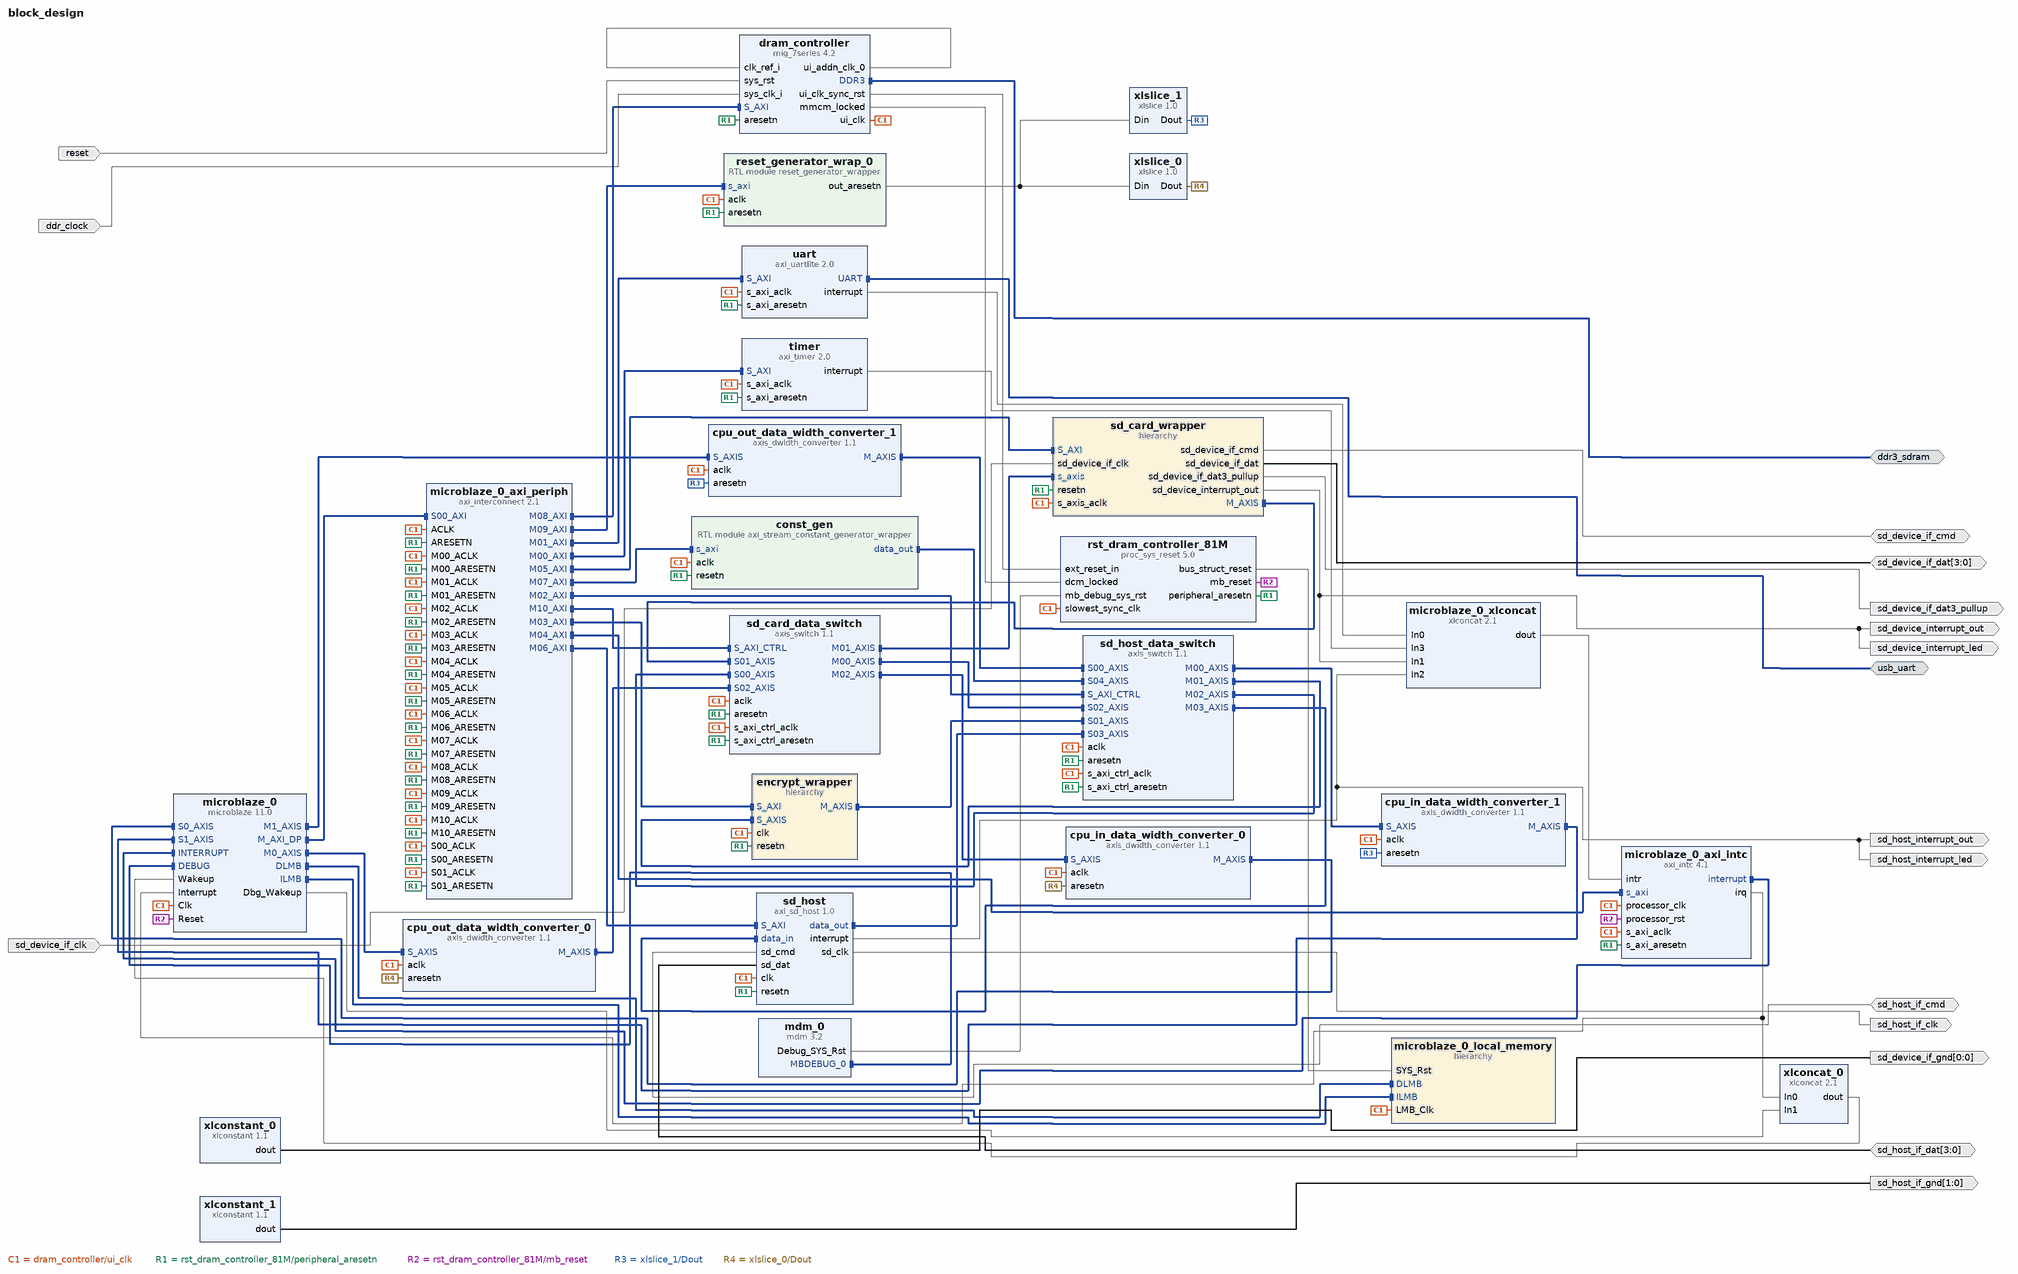
[diagram p0: block diagram of the top level]
# Vivado block design block_design, xc7s50csga324-1, Vivado 2019.2
create_bd_design block_design

create_bd_intf_port -mode Master -vlnv xilinx.com:interface:uart_rtl:1.0 usb_uart
create_bd_intf_port -mode Master -vlnv xilinx.com:interface:ddrx_rtl:1.0 ddr3_sdram
create_bd_port -dir I -type data sd_device_if_clk
create_bd_port -dir IO -type data sd_device_if_cmd
create_bd_port -dir IO -from 3 -to 0 -type data sd_device_if_dat
create_bd_port -dir O sd_device_if_dat3_pullup
create_bd_port -dir O -from 0 -to 0 sd_device_if_gnd
create_bd_port -dir O sd_device_interrupt_led
create_bd_port -dir O sd_device_interrupt_out
create_bd_port -dir O -type data sd_host_if_clk
create_bd_port -dir IO -type data sd_host_if_cmd
create_bd_port -dir IO -from 3 -to 0 -type data sd_host_if_dat
create_bd_port -dir O -from 1 -to 0 sd_host_if_gnd
create_bd_port -dir O sd_host_interrupt_led
create_bd_port -dir O sd_host_interrupt_out
create_bd_port -dir I -type rst reset
set_property -dict {CONFIG.POLARITY ACTIVE_LOW} [get_bd_ports reset]
create_bd_port -dir I -type clk ddr_clock
set_property -dict {CONFIG.FREQ_HZ 100000000 CONFIG.PHASE 0.000} [get_bd_ports ddr_clock]

create_bd_cell -type ip -vlnv xilinx.com:ip:axis_switch:1.1 sd_host_data_switch
set_property -dict [list \
  CONFIG.DECODER_REG 1 \
  CONFIG.HAS_TKEEP 0 \
  CONFIG.HAS_TLAST 1 \
  CONFIG.HAS_TSTRB 0 \
  CONFIG.M00_S00_CONNECTIVITY 0 \
  CONFIG.M00_S04_CONNECTIVITY 0 \
  CONFIG.M01_S01_CONNECTIVITY 0 \
  CONFIG.M02_S02_CONNECTIVITY 0 \
  CONFIG.M03_S03_CONNECTIVITY 0 \
  CONFIG.M03_S04_CONNECTIVITY 1 \
  CONFIG.NUM_MI 4 \
  CONFIG.NUM_SI 5 \
  CONFIG.ROUTING_MODE 1 \
  CONFIG.TDATA_NUM_BYTES 1 \
  CONFIG.TDEST_WIDTH 0 \
] [get_bd_cells sd_host_data_switch]
create_bd_cell -type ip -vlnv xilinx.com:ip:axis_dwidth_converter:1.1 cpu_in_data_width_converter_0
set_property -dict {CONFIG.M_TDATA_NUM_BYTES 4} [get_bd_cells cpu_in_data_width_converter_0]
create_bd_cell -type ip -vlnv xilinx.com:ip:axis_dwidth_converter:1.1 cpu_out_data_width_converter_0
set_property -dict {CONFIG.M_TDATA_NUM_BYTES 1} [get_bd_cells cpu_out_data_width_converter_0]
create_bd_cell -type hier encrypt_wrapper
create_bd_cell -type ip -vlnv xilinx.com:ip:mdm:3.2 mdm_0
create_bd_cell -type ip -vlnv xilinx.com:ip:microblaze:11.0 microblaze_0
set_property -dict [list \
  CONFIG.C_ADDR_TAG_BITS 0 \
  CONFIG.C_AREA_OPTIMIZED 1 \
  CONFIG.C_DCACHE_ADDR_TAG 0 \
  CONFIG.C_DEBUG_ENABLED 2 \
  CONFIG.C_D_AXI 1 \
  CONFIG.C_D_LMB 1 \
  CONFIG.C_ENABLE_DISCRETE_PORTS 1 \
  CONFIG.C_FSL_LINKS 2 \
  CONFIG.C_I_LMB 1 \
  CONFIG.C_USE_BARREL 1 \
  CONFIG.C_USE_EXTENDED_FSL_INSTR 1 \
  CONFIG.C_USE_HW_MUL 2 \
  CONFIG.C_USE_INTERRUPT 2 \
  CONFIG.C_USE_MSR_INSTR 1 \
  CONFIG.C_USE_PCMP_INSTR 1 \
  CONFIG.C_USE_REORDER_INSTR 0 \
  CONFIG.G_TEMPLATE_LIST 8 \
] [get_bd_cells microblaze_0]
create_bd_cell -type ip -vlnv xilinx.com:ip:axi_intc:4.1 microblaze_0_axi_intc
set_property -dict {CONFIG.C_HAS_FAST 1} [get_bd_cells microblaze_0_axi_intc]
create_bd_cell -type ip -vlnv xilinx.com:ip:axi_interconnect:2.1 microblaze_0_axi_periph
set_property -dict {CONFIG.NUM_MI 11 CONFIG.NUM_SI 2} [get_bd_cells microblaze_0_axi_periph]
create_bd_cell -type hier microblaze_0_local_memory
create_bd_cell -type ip -vlnv xilinx.com:ip:xlconcat:2.1 microblaze_0_xlconcat
set_property -dict {CONFIG.NUM_PORTS 4} [get_bd_cells microblaze_0_xlconcat]
create_bd_cell -type hier sd_card_wrapper
create_bd_cell -type ip -vlnv xilinx.com:ip:axi_timer:2.0 timer
set_property -dict {CONFIG.enable_timer2 1} [get_bd_cells timer]
create_bd_cell -type ip -vlnv xilinx.com:ip:axi_uartlite:2.0 uart
set_property -dict [list \
  CONFIG.C_BAUDRATE 115200 \
  CONFIG.UARTLITE_BOARD_INTERFACE usb_uart \
  CONFIG.USE_BOARD_FLOW true \
] [get_bd_cells uart]
create_bd_cell -type ip -vlnv xilinx.com:ip:xlconstant:1.1 xlconstant_0
set_property -dict {CONFIG.CONST_VAL 0} [get_bd_cells xlconstant_0]
create_bd_cell -type ip -vlnv xilinx.com:ip:xlconstant:1.1 xlconstant_1
set_property -dict {CONFIG.CONST_VAL 0 CONFIG.CONST_WIDTH 2} [get_bd_cells xlconstant_1]
create_bd_cell -type ip -vlnv xilinx.com:ip:mig_7series:4.2 dram_controller
set_property -dict [list \
  CONFIG.BOARD_MIG_PARAM Custom \
  CONFIG.RESET_BOARD_INTERFACE reset \
  CONFIG.XML_INPUT_FILE mig_a.prj \
] [get_bd_cells dram_controller]
create_bd_cell -type ip -vlnv xilinx.com:ip:proc_sys_reset:5.0 rst_dram_controller_81M
create_bd_cell -type ip -vlnv xilinx.com:ip:axis_switch:1.1 sd_card_data_switch
set_property -dict [list \
  CONFIG.DECODER_REG 1 \
  CONFIG.HAS_TKEEP 0 \
  CONFIG.HAS_TLAST 1 \
  CONFIG.HAS_TSTRB 0 \
  CONFIG.M00_S00_CONNECTIVITY 0 \
  CONFIG.M00_S02_CONNECTIVITY 0 \
  CONFIG.M01_S01_CONNECTIVITY 0 \
  CONFIG.M02_S00_CONNECTIVITY 0 \
  CONFIG.M02_S02_CONNECTIVITY 0 \
  CONFIG.NUM_MI 3 \
  CONFIG.NUM_SI 3 \
  CONFIG.ROUTING_MODE 1 \
  CONFIG.TDATA_NUM_BYTES 1 \
  CONFIG.TDEST_WIDTH 0 \
] [get_bd_cells sd_card_data_switch]
create_bd_cell -type ip -vlnv xilinx.com:ip:xlconcat:2.1 xlconcat_0
create_bd_cell -type ip -vlnv xilinx.com:ip:axis_dwidth_converter:1.1 cpu_in_data_width_converter_1
set_property -dict {CONFIG.M_TDATA_NUM_BYTES 4} [get_bd_cells cpu_in_data_width_converter_1]
create_bd_cell -type ip -vlnv xilinx.com:ip:axis_dwidth_converter:1.1 cpu_out_data_width_converter_1
set_property -dict {CONFIG.M_TDATA_NUM_BYTES 1} [get_bd_cells cpu_out_data_width_converter_1]
create_bd_cell -type module -reference axi_stream_constant_generator_wrapper const_gen
create_bd_cell -type module -reference reset_generator_wrapper reset_generator_wrap_0
create_bd_cell -type ip -vlnv xilinx.com:ip:xlslice:1.0 xlslice_0
set_property -dict {CONFIG.DIN_WIDTH 2} [get_bd_cells xlslice_0]
create_bd_cell -type ip -vlnv xilinx.com:ip:xlslice:1.0 xlslice_1
set_property -dict {CONFIG.DIN_FROM 1 CONFIG.DIN_TO 1 CONFIG.DIN_WIDTH 2 CONFIG.DOUT_WIDTH 1} [get_bd_cells xlslice_1]
create_bd_cell -type ip -vlnv user.org:user:axi_sd_host:1.0 sd_host

# ---- hierarchy /encrypt_wrapper ----
current_bd_instance /encrypt_wrapper
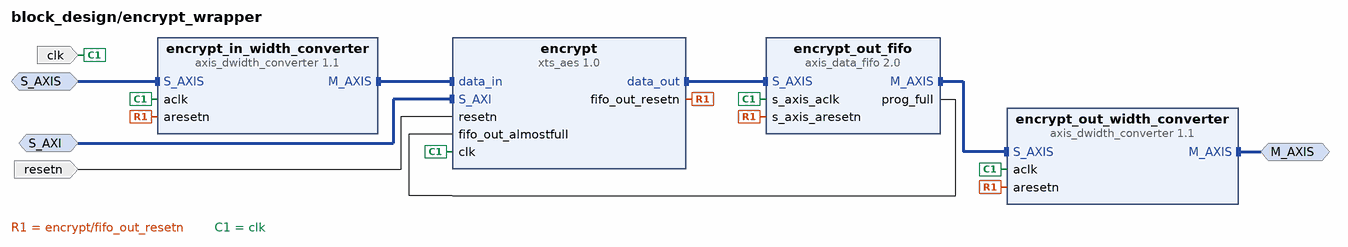
[diagram p1: block diagram inside /encrypt_wrapper]
create_bd_intf_pin -mode Master -vlnv xilinx.com:interface:axis_rtl:1.0 M_AXIS
create_bd_intf_pin -mode Slave -vlnv xilinx.com:interface:aximm_rtl:1.0 S_AXI
create_bd_intf_pin -mode Slave -vlnv xilinx.com:interface:axis_rtl:1.0 S_AXIS
create_bd_pin -dir I -type clk clk
create_bd_pin -dir I -type rst resetn

create_bd_cell -type ip -vlnv user.org:user:xts_aes:1.0 encrypt
set_property -dict {CONFIG.KEY_SIZE 512 CONFIG.TWEAK_WIDTH 32} [get_bd_cells encrypt]
create_bd_cell -type ip -vlnv xilinx.com:ip:axis_dwidth_converter:1.1 encrypt_in_width_converter
set_property -dict {CONFIG.M_TDATA_NUM_BYTES 16} [get_bd_cells encrypt_in_width_converter]
create_bd_cell -type ip -vlnv xilinx.com:ip:axis_data_fifo:2.0 encrypt_out_fifo
set_property -dict [list \
  CONFIG.FIFO_DEPTH 64 \
  CONFIG.HAS_PROG_FULL 1 \
  CONFIG.HAS_TLAST 0 \
  CONFIG.PROG_FULL_THRESH 32 \
] [get_bd_cells encrypt_out_fifo]
create_bd_cell -type ip -vlnv xilinx.com:ip:axis_dwidth_converter:1.1 encrypt_out_width_converter
set_property -dict {CONFIG.M_TDATA_NUM_BYTES 1} [get_bd_cells encrypt_out_width_converter]

# ---- hierarchy /microblaze_0_local_memory ----
current_bd_instance /microblaze_0_local_memory
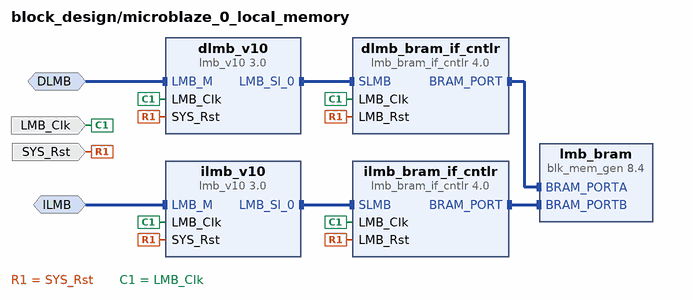
[diagram p2: block diagram inside /microblaze_0_local_memory]
create_bd_intf_pin -mode MirroredMaster -vlnv xilinx.com:interface:lmb_rtl:1.0 DLMB
create_bd_intf_pin -mode MirroredMaster -vlnv xilinx.com:interface:lmb_rtl:1.0 ILMB
create_bd_pin -dir I -type clk LMB_Clk
create_bd_pin -dir I -type rst SYS_Rst

create_bd_cell -type ip -vlnv xilinx.com:ip:lmb_bram_if_cntlr:4.0 dlmb_bram_if_cntlr
set_property -dict {CONFIG.C_ECC 0} [get_bd_cells dlmb_bram_if_cntlr]
create_bd_cell -type ip -vlnv xilinx.com:ip:lmb_v10:3.0 dlmb_v10
create_bd_cell -type ip -vlnv xilinx.com:ip:lmb_bram_if_cntlr:4.0 ilmb_bram_if_cntlr
set_property -dict {CONFIG.C_ECC 0} [get_bd_cells ilmb_bram_if_cntlr]
create_bd_cell -type ip -vlnv xilinx.com:ip:lmb_v10:3.0 ilmb_v10
create_bd_cell -type ip -vlnv xilinx.com:ip:blk_mem_gen:8.4 lmb_bram
set_property -dict [list \
  CONFIG.Enable_B Use_ENB_Pin \
  CONFIG.Memory_Type True_Dual_Port_RAM \
  CONFIG.Port_B_Clock 100 \
  CONFIG.Port_B_Enable_Rate 100 \
  CONFIG.Port_B_Write_Rate 50 \
  CONFIG.Use_RSTB_Pin true \
  CONFIG.use_bram_block BRAM_Controller \
] [get_bd_cells lmb_bram]

# ---- hierarchy /sd_card_wrapper ----
current_bd_instance /sd_card_wrapper
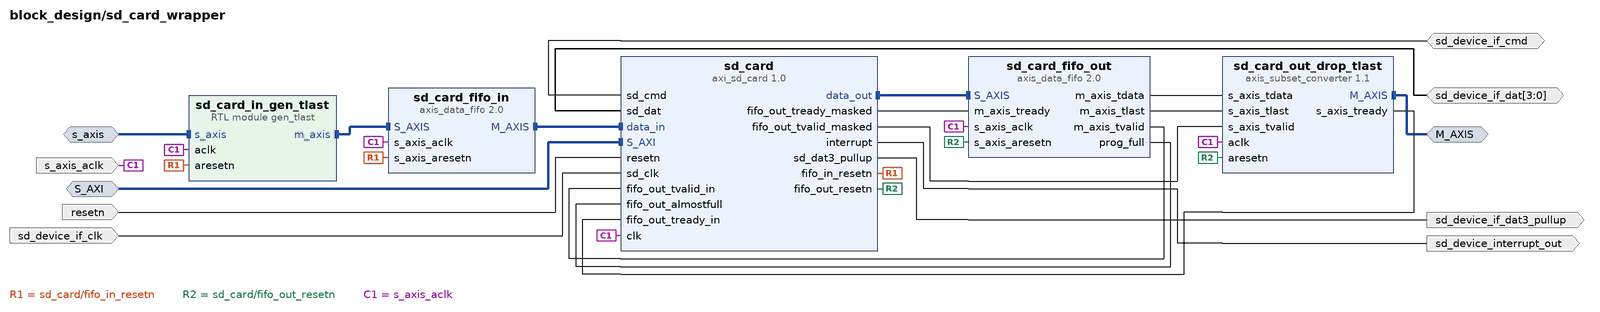
[diagram p3: block diagram inside /sd_card_wrapper]
create_bd_intf_pin -mode Master -vlnv xilinx.com:interface:axis_rtl:1.0 M_AXIS
create_bd_intf_pin -mode Slave -vlnv xilinx.com:interface:aximm_rtl:1.0 S_AXI
create_bd_intf_pin -mode Slave -vlnv xilinx.com:interface:axis_rtl:1.0 s_axis
create_bd_pin -dir I -type rst resetn
create_bd_pin -dir I -type clk s_axis_aclk
create_bd_pin -dir I sd_device_if_clk
create_bd_pin -dir IO sd_device_if_cmd
create_bd_pin -dir IO -from 3 -to 0 sd_device_if_dat
create_bd_pin -dir O sd_device_if_dat3_pullup
create_bd_pin -dir O -type intr sd_device_interrupt_out

create_bd_cell -type ip -vlnv xilinx.com:ip:axis_data_fifo:2.0 sd_card_fifo_in
set_property -dict {CONFIG.FIFO_DEPTH 1024 CONFIG.FIFO_MODE 2} [get_bd_cells sd_card_fifo_in]
create_bd_cell -type ip -vlnv xilinx.com:ip:axis_data_fifo:2.0 sd_card_fifo_out
set_property -dict [list \
  CONFIG.FIFO_DEPTH 2048 \
  CONFIG.FIFO_MODE 2 \
  CONFIG.HAS_PROG_FULL 1 \
  CONFIG.PROG_FULL_THRESH 1025 \
] [get_bd_cells sd_card_fifo_out]
create_bd_cell -type module -reference gen_tlast sd_card_in_gen_tlast
create_bd_cell -type ip -vlnv xilinx.com:ip:axis_subset_converter:1.1 sd_card_out_drop_tlast
set_property -dict {CONFIG.M_HAS_TLAST 0 CONFIG.S_HAS_TLAST 1} [get_bd_cells sd_card_out_drop_tlast]
create_bd_cell -type ip -vlnv user.org:user:axi_sd_card:1.0 sd_card

# ---- connections ----

current_bd_instance /encrypt_wrapper
connect_bd_intf_net [get_bd_intf_pins M_AXIS] [get_bd_intf_pins encrypt_out_width_converter/M_AXIS]
connect_bd_intf_net -intf_net axis_switch_0_M01_AXIS [get_bd_intf_pins S_AXIS] [get_bd_intf_pins encrypt_in_width_converter/S_AXIS]
connect_bd_intf_net [get_bd_intf_pins encrypt_out_fifo/M_AXIS] [get_bd_intf_pins encrypt_out_width_converter/S_AXIS]
connect_bd_intf_net [get_bd_intf_pins S_AXI] [get_bd_intf_pins encrypt/S_AXI]
connect_bd_intf_net [get_bd_intf_pins encrypt/data_out] [get_bd_intf_pins encrypt_out_fifo/S_AXIS]
connect_bd_intf_net -intf_net axis_dwidth_converter_0_M_AXIS [get_bd_intf_pins encrypt/data_in] [get_bd_intf_pins encrypt_in_width_converter/M_AXIS]
connect_bd_net [get_bd_pins encrypt/fifo_out_resetn] \
  [get_bd_pins encrypt_in_width_converter/aresetn] [get_bd_pins encrypt_out_fifo/s_axis_aresetn] \
  [get_bd_pins encrypt_out_width_converter/aresetn]
connect_bd_net [get_bd_pins encrypt_out_fifo/prog_full] [get_bd_pins encrypt/fifo_out_almostfull]
connect_bd_net -net microblaze_0_Clk [get_bd_pins clk] \
  [get_bd_pins encrypt/clk] [get_bd_pins encrypt_in_width_converter/aclk] [get_bd_pins encrypt_out_fifo/s_axis_aclk] \
  [get_bd_pins encrypt_out_width_converter/aclk]
connect_bd_net -net rst_clk_wiz_1_100M_peripheral_aresetn [get_bd_pins resetn] [get_bd_pins encrypt/resetn]

current_bd_instance /microblaze_0_local_memory
connect_bd_intf_net -intf_net microblaze_0_ilmb [get_bd_intf_pins ILMB] [get_bd_intf_pins ilmb_v10/LMB_M]
connect_bd_intf_net -intf_net microblaze_0_ilmb_cntlr [get_bd_intf_pins ilmb_bram_if_cntlr/BRAM_PORT] [get_bd_intf_pins lmb_bram/BRAM_PORTB]
connect_bd_intf_net -intf_net microblaze_0_dlmb_bus [get_bd_intf_pins dlmb_bram_if_cntlr/SLMB] [get_bd_intf_pins dlmb_v10/LMB_Sl_0]
connect_bd_intf_net -intf_net microblaze_0_dlmb_cntlr [get_bd_intf_pins dlmb_bram_if_cntlr/BRAM_PORT] [get_bd_intf_pins lmb_bram/BRAM_PORTA]
connect_bd_intf_net -intf_net microblaze_0_dlmb [get_bd_intf_pins DLMB] [get_bd_intf_pins dlmb_v10/LMB_M]
connect_bd_intf_net -intf_net microblaze_0_ilmb_bus [get_bd_intf_pins ilmb_bram_if_cntlr/SLMB] [get_bd_intf_pins ilmb_v10/LMB_Sl_0]
connect_bd_net [get_bd_pins SYS_Rst] \
  [get_bd_pins dlmb_bram_if_cntlr/LMB_Rst] [get_bd_pins dlmb_v10/SYS_Rst] [get_bd_pins ilmb_bram_if_cntlr/LMB_Rst] \
  [get_bd_pins ilmb_v10/SYS_Rst]
connect_bd_net -net microblaze_0_Clk [get_bd_pins LMB_Clk] \
  [get_bd_pins dlmb_bram_if_cntlr/LMB_Clk] [get_bd_pins dlmb_v10/LMB_Clk] [get_bd_pins ilmb_bram_if_cntlr/LMB_Clk] \
  [get_bd_pins ilmb_v10/LMB_Clk]
set_property HDL_ATTRIBUTE.BMM_INFO_ADDRESS_SPACE {byte  0x00000000 32 > block_design microblaze_0_local_memory/lmb_bram} [get_bd_cells dlmb_bram_if_cntlr]
set_property HDL_ATTRIBUTE.KEEP_HIERARCHY yes [get_bd_cells dlmb_bram_if_cntlr]

current_bd_instance /sd_card_wrapper
connect_bd_intf_net -intf_net axis_switch_0_M02_AXIS [get_bd_intf_pins s_axis] [get_bd_intf_pins sd_card_in_gen_tlast/s_axis]
connect_bd_intf_net -intf_net gen_tlast_0_m_axis [get_bd_intf_pins sd_card_fifo_in/S_AXIS] [get_bd_intf_pins sd_card_in_gen_tlast/m_axis]
connect_bd_intf_net -intf_net sd_card_out_pass_M_AXIS [get_bd_intf_pins M_AXIS] [get_bd_intf_pins sd_card_out_drop_tlast/M_AXIS]
connect_bd_intf_net -intf_net microblaze_0_axi_periph_M05_AXI [get_bd_intf_pins S_AXI] [get_bd_intf_pins sd_card/S_AXI]
connect_bd_intf_net -intf_net axis_data_fifo_0_M_AXIS [get_bd_intf_pins sd_card/data_in] [get_bd_intf_pins sd_card_fifo_in/M_AXIS]
connect_bd_intf_net -intf_net axi_sd_card_0_data_out [get_bd_intf_pins sd_card/data_out] [get_bd_intf_pins sd_card_fifo_out/S_AXIS]
connect_bd_net [get_bd_pins sd_device_if_cmd] [get_bd_pins sd_card/sd_cmd]
connect_bd_net [get_bd_pins sd_device_if_dat] [get_bd_pins sd_card/sd_dat]
connect_bd_net -net axi_sd_0_interrupt [get_bd_pins sd_card/interrupt] [get_bd_pins sd_device_interrupt_out]
connect_bd_net -net axi_sd_card_0_fifo_in_resetn [get_bd_pins sd_card/fifo_in_resetn] \
  [get_bd_pins sd_card_fifo_in/s_axis_aresetn] [get_bd_pins sd_card_in_gen_tlast/aresetn]
connect_bd_net -net axi_sd_card_0_fifo_out_resetn [get_bd_pins sd_card/fifo_out_resetn] \
  [get_bd_pins sd_card_fifo_out/s_axis_aresetn] [get_bd_pins sd_card_out_drop_tlast/aresetn]
connect_bd_net -net axi_sd_card_0_fifo_out_tready_masked [get_bd_pins sd_card/fifo_out_tready_masked] [get_bd_pins sd_card_fifo_out/m_axis_tready]
connect_bd_net -net axi_sd_card_0_sd_dat3_pullup [get_bd_pins sd_card/sd_dat3_pullup] [get_bd_pins sd_device_if_dat3_pullup]
connect_bd_net -net microblaze_0_Clk [get_bd_pins s_axis_aclk] \
  [get_bd_pins sd_card_fifo_in/s_axis_aclk] [get_bd_pins sd_card_fifo_out/s_axis_aclk] \
  [get_bd_pins sd_card_in_gen_tlast/aclk] [get_bd_pins sd_card_out_drop_tlast/aclk] [get_bd_pins sd_card/clk]
connect_bd_net -net rst_clk_wiz_1_100M_peripheral_aresetn [get_bd_pins resetn] [get_bd_pins sd_card/resetn]
connect_bd_net [get_bd_pins sd_card_fifo_out/m_axis_tdata] [get_bd_pins sd_card_out_drop_tlast/s_axis_tdata]
connect_bd_net [get_bd_pins sd_card_fifo_out/m_axis_tlast] [get_bd_pins sd_card_out_drop_tlast/s_axis_tlast]
connect_bd_net [get_bd_pins sd_card_fifo_out/m_axis_tvalid] [get_bd_pins sd_card/fifo_out_tvalid_in]
connect_bd_net [get_bd_pins sd_card_fifo_out/prog_full] [get_bd_pins sd_card/fifo_out_almostfull]
connect_bd_net [get_bd_pins sd_card/fifo_out_tvalid_masked] [get_bd_pins sd_card_out_drop_tlast/s_axis_tvalid]
connect_bd_net -net sd_card_out_pass_s_axis_tready [get_bd_pins sd_card_out_drop_tlast/s_axis_tready] [get_bd_pins sd_card/fifo_out_tready_in]
connect_bd_net [get_bd_pins sd_device_if_clk] [get_bd_pins sd_card/sd_clk]
set_property HDL_ATTRIBUTE.DEBUG true [get_bd_intf_nets axis_switch_0_M02_AXIS]
set_property HDL_ATTRIBUTE.DEBUG true [get_bd_intf_nets sd_card_out_pass_M_AXIS]
set_property HDL_ATTRIBUTE.DEBUG true [get_bd_intf_nets microblaze_0_axi_periph_M05_AXI]

current_bd_instance /
connect_bd_intf_net [get_bd_intf_ports ddr3_sdram] [get_bd_intf_pins dram_controller/DDR3]
connect_bd_intf_net [get_bd_intf_pins sd_host_data_switch/S03_AXIS] [get_bd_intf_pins sd_host/data_out]
connect_bd_intf_net [get_bd_intf_pins microblaze_0/DLMB] [get_bd_intf_pins microblaze_0_local_memory/DLMB]
connect_bd_intf_net -intf_net cpu_out_data_width_converter_M_AXIS [get_bd_intf_pins cpu_out_data_width_converter_0/M_AXIS] [get_bd_intf_pins sd_card_data_switch/S02_AXIS]
connect_bd_intf_net -intf_net axis_switch_0_M01_AXIS1 [get_bd_intf_pins sd_card_data_switch/M01_AXIS] [get_bd_intf_pins sd_card_wrapper/s_axis]
connect_bd_intf_net -intf_net axis_switch_0_M02_AXIS [get_bd_intf_pins sd_card_data_switch/M02_AXIS] [get_bd_intf_pins cpu_in_data_width_converter_0/S_AXIS]
connect_bd_intf_net -intf_net axi_uartlite_0_UART [get_bd_intf_ports usb_uart] [get_bd_intf_pins uart/UART]
connect_bd_intf_net [get_bd_intf_pins cpu_in_data_width_converter_1/S_AXIS] [get_bd_intf_pins sd_host_data_switch/M00_AXIS]
connect_bd_intf_net -intf_net axis_switch_0_M03_AXIS [get_bd_intf_pins sd_host_data_switch/M03_AXIS] [get_bd_intf_pins sd_host/data_in]
connect_bd_intf_net -intf_net cpu_in_data_width_converter_M_AXIS [get_bd_intf_pins cpu_in_data_width_converter_0/M_AXIS] [get_bd_intf_pins microblaze_0/S0_AXIS]
connect_bd_intf_net [get_bd_intf_pins cpu_in_data_width_converter_1/M_AXIS] [get_bd_intf_pins microblaze_0/S1_AXIS]
connect_bd_intf_net [get_bd_intf_pins const_gen/s_axi] [get_bd_intf_pins microblaze_0_axi_periph/M07_AXI]
connect_bd_intf_net [get_bd_intf_pins microblaze_0_axi_periph/M10_AXI] [get_bd_intf_pins sd_card_data_switch/S_AXI_CTRL]
connect_bd_intf_net -intf_net sd_card_wrapper_M_AXIS [get_bd_intf_pins sd_card_data_switch/S01_AXIS] [get_bd_intf_pins sd_card_wrapper/M_AXIS]
connect_bd_intf_net -intf_net encrypt_out_width_converter_M_AXIS [get_bd_intf_pins sd_host_data_switch/S01_AXIS] [get_bd_intf_pins encrypt_wrapper/M_AXIS]
connect_bd_intf_net [get_bd_intf_pins cpu_out_data_width_converter_1/S_AXIS] [get_bd_intf_pins microblaze_0/M1_AXIS]
connect_bd_intf_net [get_bd_intf_pins microblaze_0_axi_periph/M00_AXI] [get_bd_intf_pins timer/S_AXI]
connect_bd_intf_net [get_bd_intf_pins microblaze_0_axi_intc/s_axi] [get_bd_intf_pins microblaze_0_axi_periph/M04_AXI]
connect_bd_intf_net [get_bd_intf_pins cpu_out_data_width_converter_1/M_AXIS] [get_bd_intf_pins sd_host_data_switch/S00_AXIS]
connect_bd_intf_net [get_bd_intf_pins microblaze_0/ILMB] [get_bd_intf_pins microblaze_0_local_memory/ILMB]
connect_bd_intf_net [get_bd_intf_pins microblaze_0_axi_periph/M09_AXI] [get_bd_intf_pins reset_generator_wrap_0/s_axi]
connect_bd_intf_net [get_bd_intf_pins microblaze_0/INTERRUPT] [get_bd_intf_pins microblaze_0_axi_intc/interrupt]
connect_bd_intf_net [get_bd_intf_pins microblaze_0_axi_periph/M06_AXI] [get_bd_intf_pins sd_host/S_AXI]
connect_bd_intf_net -intf_net sd_host_axis_switch_M02_AXIS [get_bd_intf_pins sd_card_data_switch/S00_AXIS] [get_bd_intf_pins sd_host_data_switch/M02_AXIS]
connect_bd_intf_net [get_bd_intf_pins microblaze_0_axi_periph/M08_AXI] [get_bd_intf_pins dram_controller/S_AXI]
connect_bd_intf_net [get_bd_intf_pins microblaze_0_axi_periph/M01_AXI] [get_bd_intf_pins uart/S_AXI]
connect_bd_intf_net -intf_net axis_switch_0_M01_AXIS [get_bd_intf_pins sd_host_data_switch/M01_AXIS] [get_bd_intf_pins encrypt_wrapper/S_AXIS]
connect_bd_intf_net [get_bd_intf_pins cpu_out_data_width_converter_0/S_AXIS] [get_bd_intf_pins microblaze_0/M0_AXIS]
connect_bd_intf_net -intf_net axis_switch_0_M00_AXIS [get_bd_intf_pins sd_card_data_switch/M00_AXIS] [get_bd_intf_pins sd_host_data_switch/S02_AXIS]
connect_bd_intf_net [get_bd_intf_pins sd_host_data_switch/S_AXI_CTRL] [get_bd_intf_pins microblaze_0_axi_periph/M02_AXI]
connect_bd_intf_net -intf_net microblaze_0_axi_dp [get_bd_intf_pins microblaze_0/M_AXI_DP] [get_bd_intf_pins microblaze_0_axi_periph/S00_AXI]
connect_bd_intf_net -intf_net microblaze_0_axi_periph_M05_AXI [get_bd_intf_pins microblaze_0_axi_periph/M05_AXI] [get_bd_intf_pins sd_card_wrapper/S_AXI]
connect_bd_intf_net [get_bd_intf_pins encrypt_wrapper/S_AXI] [get_bd_intf_pins microblaze_0_axi_periph/M03_AXI]
connect_bd_intf_net [get_bd_intf_pins mdm_0/MBDEBUG_0] [get_bd_intf_pins microblaze_0/DEBUG]
connect_bd_intf_net -intf_net axi_stream_constant_0_data_out [get_bd_intf_pins sd_host_data_switch/S04_AXIS] [get_bd_intf_pins const_gen/data_out]
connect_bd_net [get_bd_ports sd_device_if_cmd] [get_bd_pins sd_card_wrapper/sd_device_if_cmd]
connect_bd_net [get_bd_ports sd_device_if_dat] [get_bd_pins sd_card_wrapper/sd_device_if_dat]
connect_bd_net [get_bd_ports sd_host_if_cmd] [get_bd_pins sd_host/sd_cmd]
connect_bd_net [get_bd_ports sd_host_if_dat] [get_bd_pins sd_host/sd_dat]
connect_bd_net -net axi_sd_0_interrupt [get_bd_pins sd_card_wrapper/sd_device_interrupt_out] \
  [get_bd_ports sd_device_interrupt_led] [get_bd_ports sd_device_interrupt_out] [get_bd_pins microblaze_0_xlconcat/In1]
connect_bd_net -net axi_sd_card_0_sd_dat3_pullup [get_bd_pins sd_card_wrapper/sd_device_if_dat3_pullup] [get_bd_ports sd_device_if_dat3_pullup]
connect_bd_net -net axi_sd_host_0_interrupt [get_bd_pins sd_host/interrupt] \
  [get_bd_ports sd_host_interrupt_led] [get_bd_ports sd_host_interrupt_out] [get_bd_pins microblaze_0_xlconcat/In2]
connect_bd_net -net axi_sd_host_0_sd_clk [get_bd_pins sd_host/sd_clk] [get_bd_ports sd_host_if_clk]
connect_bd_net -net axi_uartlite_0_interrupt [get_bd_pins uart/interrupt] [get_bd_pins microblaze_0_xlconcat/In0]
connect_bd_net -net microblaze_0_intr [get_bd_pins microblaze_0_xlconcat/dout] [get_bd_pins microblaze_0_axi_intc/intr]
connect_bd_net [get_bd_ports sd_device_if_clk] [get_bd_pins sd_card_wrapper/sd_device_if_clk]
connect_bd_net [get_bd_pins timer/interrupt] [get_bd_pins microblaze_0_xlconcat/In3]
connect_bd_net [get_bd_pins xlconstant_0/dout] [get_bd_ports sd_device_if_gnd]
connect_bd_net [get_bd_pins xlconstant_1/dout] [get_bd_ports sd_host_if_gnd]
connect_bd_net -net mig_7series_0_ui_clk [get_bd_pins dram_controller/ui_clk] \
  [get_bd_pins microblaze_0_axi_periph/M08_ACLK] [get_bd_pins sd_host_data_switch/aclk] \
  [get_bd_pins sd_host_data_switch/s_axi_ctrl_aclk] [get_bd_pins cpu_in_data_width_converter_0/aclk] \
  [get_bd_pins cpu_out_data_width_converter_0/aclk] [get_bd_pins encrypt_wrapper/clk] [get_bd_pins microblaze_0/Clk] \
  [get_bd_pins microblaze_0_axi_intc/processor_clk] [get_bd_pins microblaze_0_axi_intc/s_axi_aclk] \
  [get_bd_pins microblaze_0_axi_periph/ACLK] [get_bd_pins microblaze_0_axi_periph/M00_ACLK] \
  [get_bd_pins microblaze_0_axi_periph/M01_ACLK] [get_bd_pins microblaze_0_axi_periph/M02_ACLK] \
  [get_bd_pins microblaze_0_axi_periph/M03_ACLK] [get_bd_pins microblaze_0_axi_periph/M04_ACLK] \
  [get_bd_pins microblaze_0_axi_periph/M05_ACLK] [get_bd_pins microblaze_0_axi_periph/M06_ACLK] \
  [get_bd_pins microblaze_0_axi_periph/M07_ACLK] [get_bd_pins microblaze_0_axi_periph/S00_ACLK] \
  [get_bd_pins microblaze_0_local_memory/LMB_Clk] [get_bd_pins sd_card_wrapper/s_axis_aclk] [get_bd_pins timer/s_axi_aclk] \
  [get_bd_pins uart/s_axi_aclk] [get_bd_pins rst_dram_controller_81M/slowest_sync_clk] \
  [get_bd_pins microblaze_0_axi_periph/M09_ACLK] [get_bd_pins sd_card_data_switch/aclk] \
  [get_bd_pins sd_card_data_switch/s_axi_ctrl_aclk] [get_bd_pins microblaze_0_axi_periph/M10_ACLK] \
  [get_bd_pins microblaze_0_axi_periph/S01_ACLK] [get_bd_pins cpu_in_data_width_converter_1/aclk] \
  [get_bd_pins cpu_out_data_width_converter_1/aclk] [get_bd_pins const_gen/aclk] [get_bd_pins reset_generator_wrap_0/aclk] \
  [get_bd_pins sd_host/clk]
connect_bd_net [get_bd_pins dram_controller/ui_addn_clk_0] [get_bd_pins dram_controller/clk_ref_i]
connect_bd_net [get_bd_pins dram_controller/ui_clk_sync_rst] [get_bd_pins rst_dram_controller_81M/ext_reset_in]
connect_bd_net [get_bd_pins dram_controller/mmcm_locked] [get_bd_pins rst_dram_controller_81M/dcm_locked]
connect_bd_net [get_bd_pins rst_dram_controller_81M/peripheral_aresetn] \
  [get_bd_pins microblaze_0_axi_periph/M08_ARESETN] [get_bd_pins sd_host_data_switch/aresetn] \
  [get_bd_pins microblaze_0_axi_periph/ARESETN] [get_bd_pins microblaze_0_axi_periph/M00_ARESETN] \
  [get_bd_pins microblaze_0_axi_periph/M01_ARESETN] [get_bd_pins microblaze_0_axi_periph/M02_ARESETN] \
  [get_bd_pins microblaze_0_axi_periph/M03_ARESETN] [get_bd_pins microblaze_0_axi_periph/M04_ARESETN] \
  [get_bd_pins microblaze_0_axi_periph/M05_ARESETN] [get_bd_pins microblaze_0_axi_periph/M06_ARESETN] \
  [get_bd_pins microblaze_0_axi_periph/M07_ARESETN] [get_bd_pins microblaze_0_axi_periph/S00_ARESETN] \
  [get_bd_pins sd_host_data_switch/s_axi_ctrl_aresetn] [get_bd_pins encrypt_wrapper/resetn] \
  [get_bd_pins microblaze_0_axi_intc/s_axi_aresetn] [get_bd_pins sd_card_wrapper/resetn] [get_bd_pins timer/s_axi_aresetn] \
  [get_bd_pins uart/s_axi_aresetn] [get_bd_pins dram_controller/aresetn] [get_bd_pins microblaze_0_axi_periph/M09_ARESETN] \
  [get_bd_pins sd_card_data_switch/aresetn] [get_bd_pins sd_card_data_switch/s_axi_ctrl_aresetn] \
  [get_bd_pins microblaze_0_axi_periph/M10_ARESETN] [get_bd_pins microblaze_0_axi_periph/S01_ARESETN] \
  [get_bd_pins const_gen/resetn] [get_bd_pins reset_generator_wrap_0/aresetn] [get_bd_pins sd_host/resetn]
connect_bd_net [get_bd_pins rst_dram_controller_81M/mb_reset] [get_bd_pins microblaze_0_axi_intc/processor_rst] [get_bd_pins microblaze_0/Reset]
connect_bd_net -net SYS_Rst_1 [get_bd_pins rst_dram_controller_81M/bus_struct_reset] [get_bd_pins microblaze_0_local_memory/SYS_Rst]
connect_bd_net [get_bd_pins mdm_0/Debug_SYS_Rst] [get_bd_pins rst_dram_controller_81M/mb_debug_sys_rst]
connect_bd_net [get_bd_ports reset] [get_bd_pins dram_controller/sys_rst]
connect_bd_net [get_bd_ports ddr_clock] [get_bd_pins dram_controller/sys_clk_i]
connect_bd_net [get_bd_pins xlconcat_0/dout] [get_bd_pins microblaze_0/Wakeup]
connect_bd_net [get_bd_pins microblaze_0_axi_intc/irq] [get_bd_pins microblaze_0/Interrupt] [get_bd_pins xlconcat_0/In0]
connect_bd_net [get_bd_pins microblaze_0/Dbg_Wakeup] [get_bd_pins xlconcat_0/In1]
connect_bd_net [get_bd_pins reset_generator_wrap_0/out_aresetn] [get_bd_pins xlslice_0/Din] [get_bd_pins xlslice_1/Din]
connect_bd_net [get_bd_pins xlslice_1/Dout] [get_bd_pins cpu_out_data_width_converter_1/aresetn] [get_bd_pins cpu_in_data_width_converter_1/aresetn]
connect_bd_net [get_bd_pins xlslice_0/Dout] [get_bd_pins cpu_out_data_width_converter_0/aresetn] [get_bd_pins cpu_in_data_width_converter_0/aresetn]
set_property HDL_ATTRIBUTE.BMM_INFO_PROCESSOR {microblaze-le > block_design microblaze_0_local_memory/dlmb_bram_if_cntlr} [get_bd_cells microblaze_0]
set_property HDL_ATTRIBUTE.KEEP_HIERARCHY yes [get_bd_cells microblaze_0]
set_property HDL_ATTRIBUTE.DEBUG true [get_bd_intf_nets axis_switch_0_M01_AXIS1]
set_property HDL_ATTRIBUTE.MARK_DEBUG true [get_bd_intf_nets axis_switch_0_M01_AXIS1]
set_property HDL_ATTRIBUTE.DEBUG true [get_bd_intf_nets axis_switch_0_M03_AXIS]
set_property HDL_ATTRIBUTE.MARK_DEBUG true [get_bd_intf_nets axis_switch_0_M03_AXIS]
set_property HDL_ATTRIBUTE.DEBUG true [get_bd_intf_nets sd_card_wrapper_M_AXIS]
set_property HDL_ATTRIBUTE.MARK_DEBUG true [get_bd_intf_nets sd_card_wrapper_M_AXIS]
set_property HDL_ATTRIBUTE.DEBUG true [get_bd_intf_nets sd_host_axis_switch_M02_AXIS]
set_property HDL_ATTRIBUTE.MARK_DEBUG true [get_bd_intf_nets sd_host_axis_switch_M02_AXIS]
set_property HDL_ATTRIBUTE.DEBUG true [get_bd_intf_nets axis_switch_0_M00_AXIS]
set_property HDL_ATTRIBUTE.MARK_DEBUG true [get_bd_intf_nets axis_switch_0_M00_AXIS]
set_property HDL_ATTRIBUTE.DEBUG true [get_bd_intf_nets microblaze_0_axi_periph_M05_AXI]
set_property HDL_ATTRIBUTE.MARK_DEBUG true [get_bd_intf_nets microblaze_0_axi_periph_M05_AXI]

# ---- address map ----
assign_bd_address -offset 0x00000000 -range 128K -target_address_space [get_bd_addr_spaces microblaze_0/Data] [get_bd_addr_segs microblaze_0_local_memory/dlmb_bram_if_cntlr/SLMB/Mem]
assign_bd_address -offset 0x40600000 -range 64K -target_address_space [get_bd_addr_spaces microblaze_0/Data] [get_bd_addr_segs uart/S_AXI/Reg]
assign_bd_address -offset 0x41200000 -range 64K -target_address_space [get_bd_addr_spaces microblaze_0/Data] [get_bd_addr_segs microblaze_0_axi_intc/S_AXI/Reg]
assign_bd_address -offset 0x41C00000 -range 64K -target_address_space [get_bd_addr_spaces microblaze_0/Data] [get_bd_addr_segs timer/S_AXI/Reg]
assign_bd_address -offset 0x44A00000 -range 64K -target_address_space [get_bd_addr_spaces microblaze_0/Data] [get_bd_addr_segs sd_card_wrapper/sd_card/S_AXI/S_AXI_reg]
assign_bd_address -offset 0x44A10000 -range 64K -target_address_space [get_bd_addr_spaces microblaze_0/Data] [get_bd_addr_segs sd_host/S_AXI/REG]
assign_bd_address -offset 0x44A20000 -range 64K -target_address_space [get_bd_addr_spaces microblaze_0/Data] [get_bd_addr_segs sd_host_data_switch/S_AXI_CTRL/Reg]
assign_bd_address -offset 0x44A30000 -range 64K -target_address_space [get_bd_addr_spaces microblaze_0/Data] [get_bd_addr_segs encrypt_wrapper/encrypt/S_AXI/S_AXI_reg]
assign_bd_address -offset 0x44A40000 -range 64K -target_address_space [get_bd_addr_spaces microblaze_0/Data] [get_bd_addr_segs const_gen/s_axi/reg0]
assign_bd_address -offset 0x44A50000 -range 64K -target_address_space [get_bd_addr_spaces microblaze_0/Data] [get_bd_addr_segs sd_card_data_switch/S_AXI_CTRL/Reg]
assign_bd_address -offset 0x44A60000 -range 64K -target_address_space [get_bd_addr_spaces microblaze_0/Data] [get_bd_addr_segs reset_generator_wrap_0/s_axi/reg0]
assign_bd_address -offset 0x80000000 -range 256M -target_address_space [get_bd_addr_spaces microblaze_0/Data] [get_bd_addr_segs dram_controller/memmap/memaddr]
assign_bd_address -offset 0x00000000 -range 128K -target_address_space [get_bd_addr_spaces microblaze_0/Instruction] [get_bd_addr_segs microblaze_0_local_memory/ilmb_bram_if_cntlr/SLMB/Mem]

validate_bd_design
save_bd_design
